# Altium schematic sheet [2] NBU-1012, PCA-10.SchDoc
size A3; DocumentNumber: 7; SheetNumber: 7; SheetTotal: 10
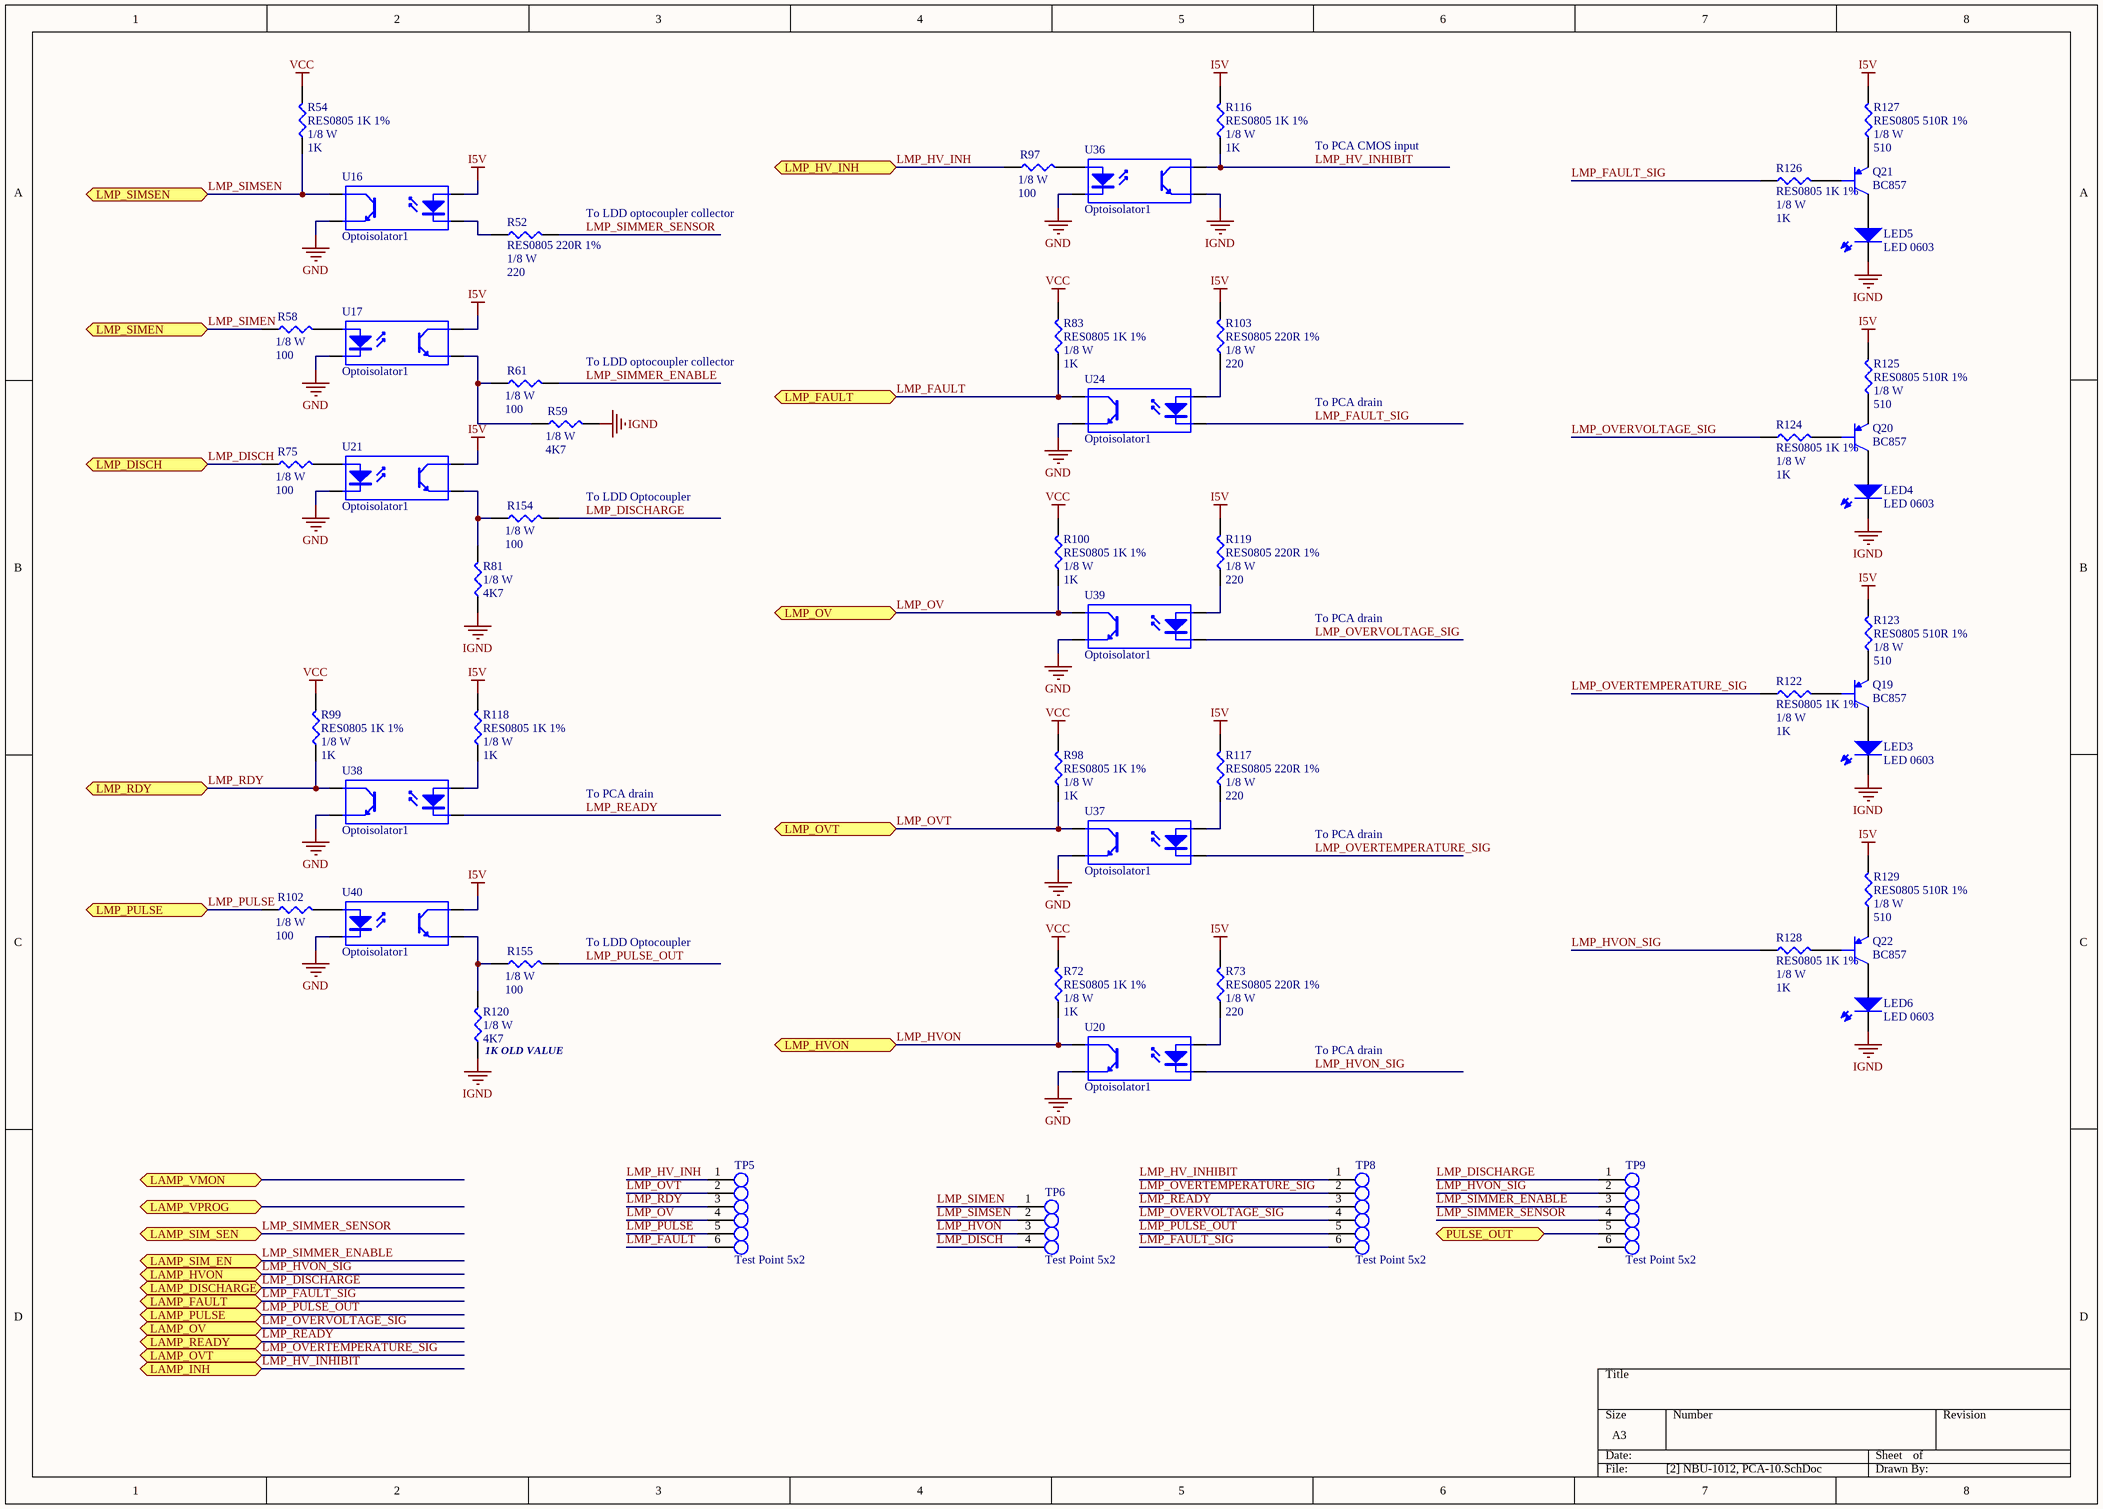
[diagram p0: [2] NBU-1012, PCA-10.SchDoc]

## Parts
LED3  LED 0603  [PLCC-2]
LED4  LED 0603  [PLCC-2]
LED5  LED 0603  [PLCC-2]
LED6  LED 0603  [PLCC-2]
Q19  BC857  [SOT23]
Q20  BC857  [SOT23]
Q21  BC857  [SOT23]
Q22  BC857  [SOT23]
R52  RES0805 220R 1%  value 220  Rating: 1/8 W  [RES0805]
R54  RES0805 1K 1%  value 1K  Rating: 1/8 W  [RES0805]
R58  value 100  Rating: 1/8 W  [RES0805]  (hidden comment: RES0805 100R 1%)
R59  value 4K7  Rating: 1/8 W  [RES0805]  (hidden comment: RES0805 4K7 1%)
R61  value 100  Rating: 1/8 W  [RES0805]  (hidden comment: RES0805 100R 1%)
R72  RES0805 1K 1%  value 1K  Rating: 1/8 W  [RES0805]
R73  RES0805 220R 1%  value 220  Rating: 1/8 W  [RES0805]
R75  value 100  Rating: 1/8 W  [RES0805]  (hidden comment: RES0805 100R 1%)
R81  value 4K7  Rating: 1/8 W  [RES0805]  (hidden comment: RES0805 4K7 1%)
R83  RES0805 1K 1%  value 1K  Rating: 1/8 W  [RES0805]
R97  value 100  Rating: 1/8 W  [RES0805]  (hidden comment: RES0805 100R 1%)
R98  RES0805 1K 1%  value 1K  Rating: 1/8 W  [RES0805]
R99  RES0805 1K 1%  value 1K  Rating: 1/8 W  [RES0805]
R100  RES0805 1K 1%  value 1K  Rating: 1/8 W  [RES0805]
R102  value 100  Rating: 1/8 W  [RES0805]  (hidden comment: RES0805 100R 1%)
R103  RES0805 220R 1%  value 220  Rating: 1/8 W  [RES0805]
R116  RES0805 1K 1%  value 1K  Rating: 1/8 W  [RES0805]
R117  RES0805 220R 1%  value 220  Rating: 1/8 W  [RES0805]
R118  RES0805 1K 1%  value 1K  Rating: 1/8 W  [RES0805]
R119  RES0805 220R 1%  value 220  Rating: 1/8 W  [RES0805]
R120  value 4K7  Rating: 1/8 W  [RES0805]  (hidden comment: RES0805 4K7 1%)
R122  RES0805 1K 1%  value 1K  Rating: 1/8 W  [RES0805]
R123  RES0805 510R 1%  value 510  Rating: 1/8 W  [RES0805]
R124  RES0805 1K 1%  value 1K  Rating: 1/8 W  [RES0805]
R125  RES0805 510R 1%  value 510  Rating: 1/8 W  [RES0805]
R126  RES0805 1K 1%  value 1K  Rating: 1/8 W  [RES0805]
R127  RES0805 510R 1%  value 510  Rating: 1/8 W  [RES0805]
R128  RES0805 1K 1%  value 1K  Rating: 1/8 W  [RES0805]
R129  RES0805 510R 1%  value 510  Rating: 1/8 W  [RES0805]
R154  value 100  Rating: 1/8 W  [RES0805]  (hidden comment: RES0805 100R 1%)
R155  value 100  Rating: 1/8 W  [RES0805]  (hidden comment: RES0805 100R 1%)
TP5  Test Point 5x2  [PG-1.5-13.5-6P-2.54PH]
TP6  Test Point 5x2  [PG-1.5-13.5-4P-2.54PH]
TP8  Test Point 5x2  [PG-1.5-13.5-6P-2.54PH]
TP9  Test Point 5x2  [PG-1.5-13.5-6P-2.54PH]
U16  Optoisolator1  [DIP-4]
U17  Optoisolator1  [DIP-4]
U20  Optoisolator1  [DIP-4]
U21  Optoisolator1  [DIP-4]
U24  Optoisolator1  [DIP-4]
U36  Optoisolator1  [DIP-4]
U37  Optoisolator1  [DIP-4]
U38  Optoisolator1  [DIP-4]
U39  Optoisolator1  [DIP-4]
U40  Optoisolator1  [DIP-4]

## Ports
LAMP_DISCHARGE, LAMP_FAULT, LAMP_HVON, LAMP_INH, LAMP_OV, LAMP_OVT, LAMP_PULSE, LAMP_READY, LAMP_SIM_EN, LAMP_SIM_SEN, LAMP_VMON, LAMP_VPROG, LMP_DISCH, LMP_FAULT, LMP_HV_INH, LMP_HVON, LMP_OV, LMP_OVT, LMP_PULSE, LMP_RDY, LMP_SIMEN, LMP_SIMSEN, PULSE_OUT

## Nets
GND: U16.3(E) U17.2(K) U20.3(E) U21.2(K) U24.3(E) U36.2(K) U37.3(E) U38.3(E) U39.3(E) U40.2(K)
I5V: R73.2 R103.2 R116.2 R117.2 R118.2 R119.2 R123.2 R125.2 R127.2 R129.2 U16.1(A) U17.4(C) U21.4(C) U40.4(C)
IGND: LED3.1 LED4.1 LED5.1 LED6.1 R59.2 R81.1 R120.1 U36.3(E)
VCC: R54.2 R72.2 R83.2 R98.2 R99.2 R100.2
LMP_DISCH: R75.1 TP6.4 ; port LMP_DISCH
LMP_DISCHARGE: R154.2 TP9.1 ; port LAMP_DISCHARGE
LMP_FAULT: R83.1 TP5.6 U24.4(C) ; port LMP_FAULT
LMP_FAULT_SIG: R126.1 TP8.6 U24.2(K) ; port LAMP_FAULT
LMP_HV_INH: R97.1 TP5.1 ; port LMP_HV_INH
LMP_HV_INHIBIT: R116.1 TP8.1 U36.4(C) ; port LAMP_INH
LMP_HVON: R72.1 TP6.3 U20.4(C) ; port LMP_HVON
LMP_HVON_SIG: R128.1 TP9.2 U20.2(K) ; port LAMP_HVON
LMP_OV: R100.1 TP5.4 U39.4(C) ; port LMP_OV
LMP_OVERTEMPERATURE_SIG: R122.1 TP8.2 U37.2(K) ; port LAMP_OVT
LMP_OVERVOLTAGE_SIG: R124.1 TP8.4 U39.2(K) ; port LAMP_OV
LMP_OVT: R98.1 TP5.2 U37.4(C) ; port LMP_OVT
LMP_PULSE: R102.1 TP5.5 ; port LMP_PULSE
LMP_PULSE_OUT: R155.2 TP8.5 ; port LAMP_PULSE
LMP_RDY: R99.1 TP5.3 U38.4(C) ; port LMP_RDY
LMP_READY: TP8.3 U38.2(K) ; port LAMP_READY
LMP_SIMEN: R58.1 TP6.1 ; port LMP_SIMEN
LMP_SIMMER_ENABLE: R61.2 TP9.3 ; port LAMP_SIM_EN
LMP_SIMMER_SENSOR: R52.2 TP9.4 ; port LAMP_SIM_SEN
LMP_SIMSEN: R54.1 TP6.2 U16.4(C) ; port LMP_SIMSEN
PULSE_OUT: TP9.5 ; port PULSE_OUT
NetLED3_2: LED3.2 Q19.3
NetLED4_2: LED4.2 Q20.3
NetLED5_2: LED5.2 Q21.3
NetLED6_2: LED6.2 Q22.3
NetQ19_1: Q19.1 R122.2
NetQ19_2: Q19.2 R123.1
NetQ20_1: Q20.1 R124.2
NetQ20_2: Q20.2 R125.1
NetQ21_1: Q21.1 R126.2
NetQ21_2: Q21.2 R127.1
NetQ22_1: Q22.1 R128.2
NetQ22_2: Q22.2 R129.1
NetR52_1: R52.1 U16.2(K)
NetR58_2: R58.2 U17.1(A)
NetR59_1: R59.1 R61.1 U17.3(E)
NetR73_1: R73.1 U20.1(A)
NetR75_2: R75.2 U21.1(A)
NetR81_2: R81.2 R154.1 U21.3(E)
NetR97_2: R97.2 U36.1(A)
NetR102_2: R102.2 U40.1(A)
NetR103_1: R103.1 U24.1(A)
NetR117_1: R117.1 U37.1(A)
NetR118_1: R118.1 U38.1(A)
NetR119_1: R119.1 U39.1(A)
NetR120_2: R120.2 R155.1 U40.3(E)

Not connected (* = marked no-connect by the designer): TP9 6

## Notes on the sheet
- To PCA CMOS input
- (near R52) To LDD optocoupler collector
- To LDD optocoupler collector
- To PCA drain
- To LDD Optocoupler
- (near R155) To LDD Optocoupler
- (near R120) 1K OLD VALUE

## Library data of the parts
LED3-LED6 = LED0603
Q19-Q22 = BC857: PNP Transistor; Manufacturer: NXP; Manufacturer Part Number: BC857A.215
R52 R73 R103 R117 R119 = RES0805 220R 1%: Think Film Chip resistor; Manufacturer Part Number: RC0805JR-07220R; Temperature Coefficient: 100ppm/K; Tolerance: 1%; Type: ThickFilm
R54 R72 R83 R98-R100 R116 R118 R122 R124 R126 R128 = RES0805 1K 1%: Think Film Chip resistor; Manufacturer Part Number: RC0805FR-071KL; Temperature Coefficient: 100ppm/K; Tolerance: 1%; Type: ThickFilm
R58 R61 R75 R97 R102 R154 R155 = RES0805 100R 1%: Think Film Chip resistor; Manufacturer Part Number: RC0805FR-07100RL; Temperature Coefficient: 100ppm/K; Tolerance: 1%; Type: ThickFilm
R59 R81 R120 = RES0805 4K7 1%: Think Film Chip resistor; Manufacturer Part Number: RC0805FR-074K7L; Temperature Coefficient: 100ppm/K; Tolerance: 1%; Type: ThickFilm
R123 R125 R127 R129 = RES0805 510R 1%: Think Film Chip resistor; Manufacturer Part Number: RC0805FR-07510RL; Temperature Coefficient: 100ppm/K; Tolerance: 1%; Type: ThickFilm
TP5 TP8 TP9 = PG-1.5-13.5-6P-2.54PH
TP6 = PG-1.5-13.5-4P-2.54PH
U16 U17 U20 U21 U24 U36-U40 = Optoisolator1: 4-Pin Phototransistor Optocoupler; Published: 24-Mar-1999; LatestRevisionDate: 04-Mar-2005; LatestRevisionNote: Sch pins 3 & 4 Swapped.; DatasheetVersion: Nov-2003; PackageReference: DIP-4; Publisher: Altium Limited